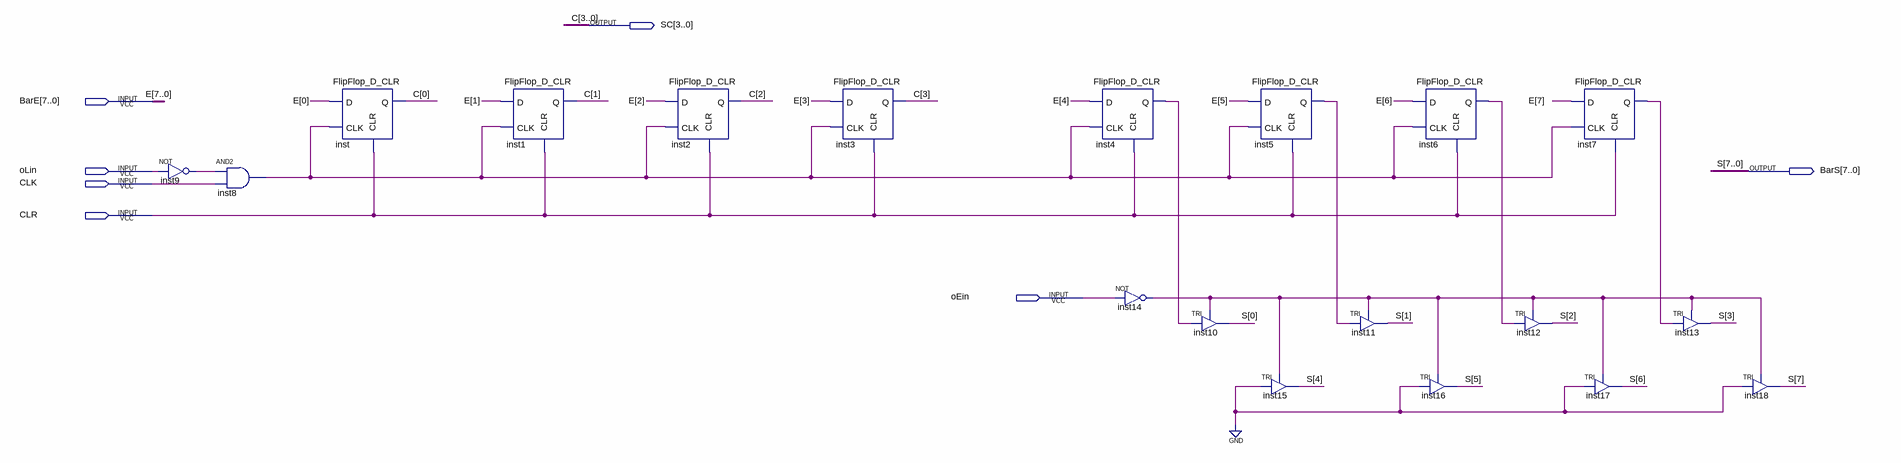
[diagram p0: schematic sheet]
// Quartus schematic Registrador_de_Instrucoes.bdf as structural Verilog: 19 symbols, 7 pins
module Registrador_de_Instrucoes (
  input  [7:0] BarE,
  input  oLin,
  input  CLK,
  input  CLR,
  input  oEin,
  output [3:0] SC,
  output [7:0] BarS
);

  wire inst4_q, inst5_q, inst6_q, inst7_q, inst8_out, inst9_out, inst14_out;

  not inst9 (inst9_out, oLin);
  and inst8 (inst8_out, inst9_out, CLK);
  FlipFlop_D_CLR inst (.D(BarE[0]), .CLK(inst8_out), .CLR(CLR), .Q(SC[0]));
  FlipFlop_D_CLR inst1 (.D(BarE[1]), .CLK(inst8_out), .CLR(CLR), .Q(SC[1]));
  FlipFlop_D_CLR inst2 (.D(BarE[2]), .CLK(inst8_out), .CLR(CLR), .Q(SC[2]));
  FlipFlop_D_CLR inst3 (.D(BarE[3]), .CLK(inst8_out), .CLR(CLR), .Q(SC[3]));
  FlipFlop_D_CLR inst4 (.D(BarE[4]), .CLK(inst8_out), .CLR(CLR), .Q(inst4_q));
  not inst14 (inst14_out, oEin);
  TRI inst10 (.IN(inst4_q), .OE(inst14_out), .OUT(BarS[0]));
  FlipFlop_D_CLR inst5 (.D(BarE[5]), .CLK(inst8_out), .CLR(CLR), .Q(inst5_q));
  TRI inst15 (.IN(1'b0), .OE(inst14_out), .OUT(BarS[4]));
  TRI inst11 (.IN(inst5_q), .OE(inst14_out), .OUT(BarS[1]));
  FlipFlop_D_CLR inst6 (.D(BarE[6]), .CLK(inst8_out), .CLR(CLR), .Q(inst6_q));
  TRI inst16 (.IN(1'b0), .OE(inst14_out), .OUT(BarS[5]));
  TRI inst12 (.IN(inst6_q), .OE(inst14_out), .OUT(BarS[2]));
  FlipFlop_D_CLR inst7 (.D(BarE[7]), .CLK(inst8_out), .CLR(CLR), .Q(inst7_q));
  TRI inst17 (.IN(1'b0), .OE(inst14_out), .OUT(BarS[6]));
  TRI inst13 (.IN(inst7_q), .OE(inst14_out), .OUT(BarS[3]));
  TRI inst18 (.IN(1'b0), .OE(inst14_out), .OUT(BarS[7]));

  // Other names for the same wires on the sheet: C[3:0] = SC; E[7:0] = BarE; S[7:0] = BarS
endmodule
